# Altium schematic sheet main.SchDoc
size A3; Author: Lohit Prakash Sundararajan; SheetNumber: 1; SheetTotal: 2; SPICEModelCacheZEHVCAGG: <root> / <DocumentId>ZEHVCAGG</DocumentId> / </root>
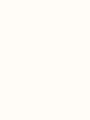
[diagram p0: main.SchDoc]